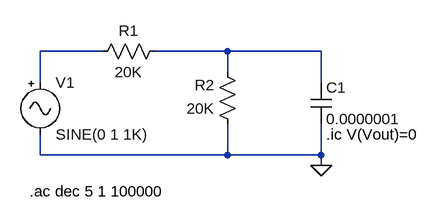
[diagram p0: schematic ELEN 115 Lab 2 Part 4.asc]
ELEN 115 Lab 2 Part 4.asc, the LTspice schematic file:
Version 4
SHEET 1 880 680
WIRE 48 112 -48 112
WIRE 240 112 128 112
WIRE 384 112 240 112
WIRE 240 144 240 112
WIRE -48 160 -48 112
WIRE 384 160 384 112
WIRE -48 272 -48 240
WIRE 240 272 240 224
WIRE 240 272 -48 272
WIRE 384 272 384 224
WIRE 384 272 240 272
WIRE 384 288 384 272
FLAG 384 288 0
SYMBOL res 144 96 R90
WINDOW 0 0 56 VBottom 2
WINDOW 3 32 56 VTop 2
SYMATTR InstName R1
SYMATTR Value 20K
SYMBOL res 256 240 R180
WINDOW 0 36 76 Left 2
WINDOW 3 36 40 Left 2
SYMATTR InstName R2
SYMATTR Value 20K
SYMBOL cap 368 160 R0
SYMATTR InstName C1
SYMATTR Value 0.0000001
SYMBOL Misc\\signal -48 144 R0
SYMATTR InstName V1
TEXT 392 240 Left 2 !.ic V(Vout)=0
TEXT -64 328 Left 2 !.ac dec 5 1 100000

The netlist it stands for:
* ELEN 115 Lab 2 Part 4.asc
R1 N002 N001 20K
R2 0 N002 20K
C1 N002 0 0.0000001
V1 N001 0 SINE(0 1 1K)
.ic V(Vout)=0
.ac dec 5 1 100000
.backanno
.end